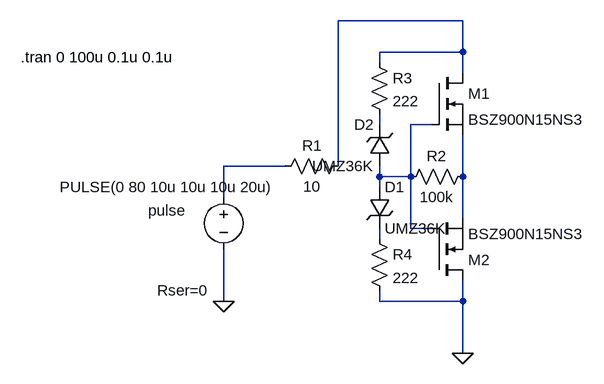
[diagram p0: schematic protection_circuitry_transformer_overvoltage.asc]
protection_circuitry_transformer_overvoltage.asc, the LTspice schematic file:
Version 4
SHEET 1 880 680
WIRE 240 -48 48 -48
WIRE 240 0 240 -48
WIRE 240 0 112 0
WIRE 112 16 112 0
WIRE 240 32 240 0
WIRE 112 112 112 96
WIRE 192 112 160 112
WIRE -32 176 -128 176
WIRE 48 176 48 -48
WIRE 112 192 112 176
WIRE 160 192 160 112
WIRE 160 192 112 192
WIRE 240 192 240 128
WIRE 112 208 112 192
WIRE -128 224 -128 176
WIRE 240 256 240 192
WIRE 160 272 160 192
WIRE 192 272 160 272
WIRE 112 288 112 272
WIRE -128 384 -128 304
WIRE 112 384 112 368
WIRE 240 384 240 352
WIRE 240 384 112 384
WIRE 240 464 240 384
FLAG -128 384 0
FLAG 240 464 0
SYMBOL voltage -128 208 R0
WINDOW 0 -116 36 Left 2
WINDOW 3 -252 0 Left 2
WINDOW 123 0 0 Left 0
WINDOW 39 -102 159 Left 2
SYMATTR InstName pulse
SYMATTR Value PULSE(0 80 10u 10u 10u 20u)
SYMATTR SpiceLine Rser=0
SYMBOL res 64 160 R90
WINDOW 0 0 56 VBottom 2
WINDOW 3 32 56 VTop 2
SYMATTR InstName R1
SYMATTR Value 10
SYMBOL nmos 192 32 R0
SYMATTR InstName M1
SYMATTR Value BSZ900N15NS3
SYMBOL zener 96 208 R0
SYMATTR InstName D1
SYMATTR Value UMZ36K
SYMATTR Description Diode
SYMATTR Type diode
SYMBOL res 144 208 R270
WINDOW 0 32 56 VTop 2
WINDOW 3 0 56 VBottom 2
SYMATTR InstName R2
SYMATTR Value 100k
SYMBOL nmos 192 352 M180
SYMATTR InstName M2
SYMATTR Value BSZ900N15NS3
SYMBOL zener 128 176 R180
WINDOW 0 24 64 Left 2
WINDOW 3 24 0 Left 2
SYMATTR InstName D2
SYMATTR Value UMZ36K
SYMATTR Description Diode
SYMATTR Type diode
SYMBOL res 96 0 R0
SYMATTR InstName R3
SYMATTR Value 222
SYMBOL res 96 272 R0
SYMATTR InstName R4
SYMATTR Value 222
TEXT -440 8 Left 2 !.tran 0 100u 0.1u 0.1u

The netlist it stands for:
* protection_circuitry_transformer_overvoltage.asc
V§pulse N004 0 PULSE(0 80 10u 10u 10u 20u) Rser=0
R1 N001 N004 10
M1 N001 N003 N005 N005 BSZ900N15NS3
D1 N003 N006 UMZ36K
R2 N003 N005 100k
M2 0 N003 N005 N005 BSZ900N15NS3
D2 N003 N002 UMZ36K
R3 N001 N002 222
R4 N006 0 222
.model D D
.lib standard.dio
.model NMOS NMOS
.model PMOS PMOS
.lib standard.mos
.tran 0 100u 0.1u 0.1u
.backanno
.end